# EAGLE design uc4h cube carrier v0310r-imx (EAGLE 7.5.0)
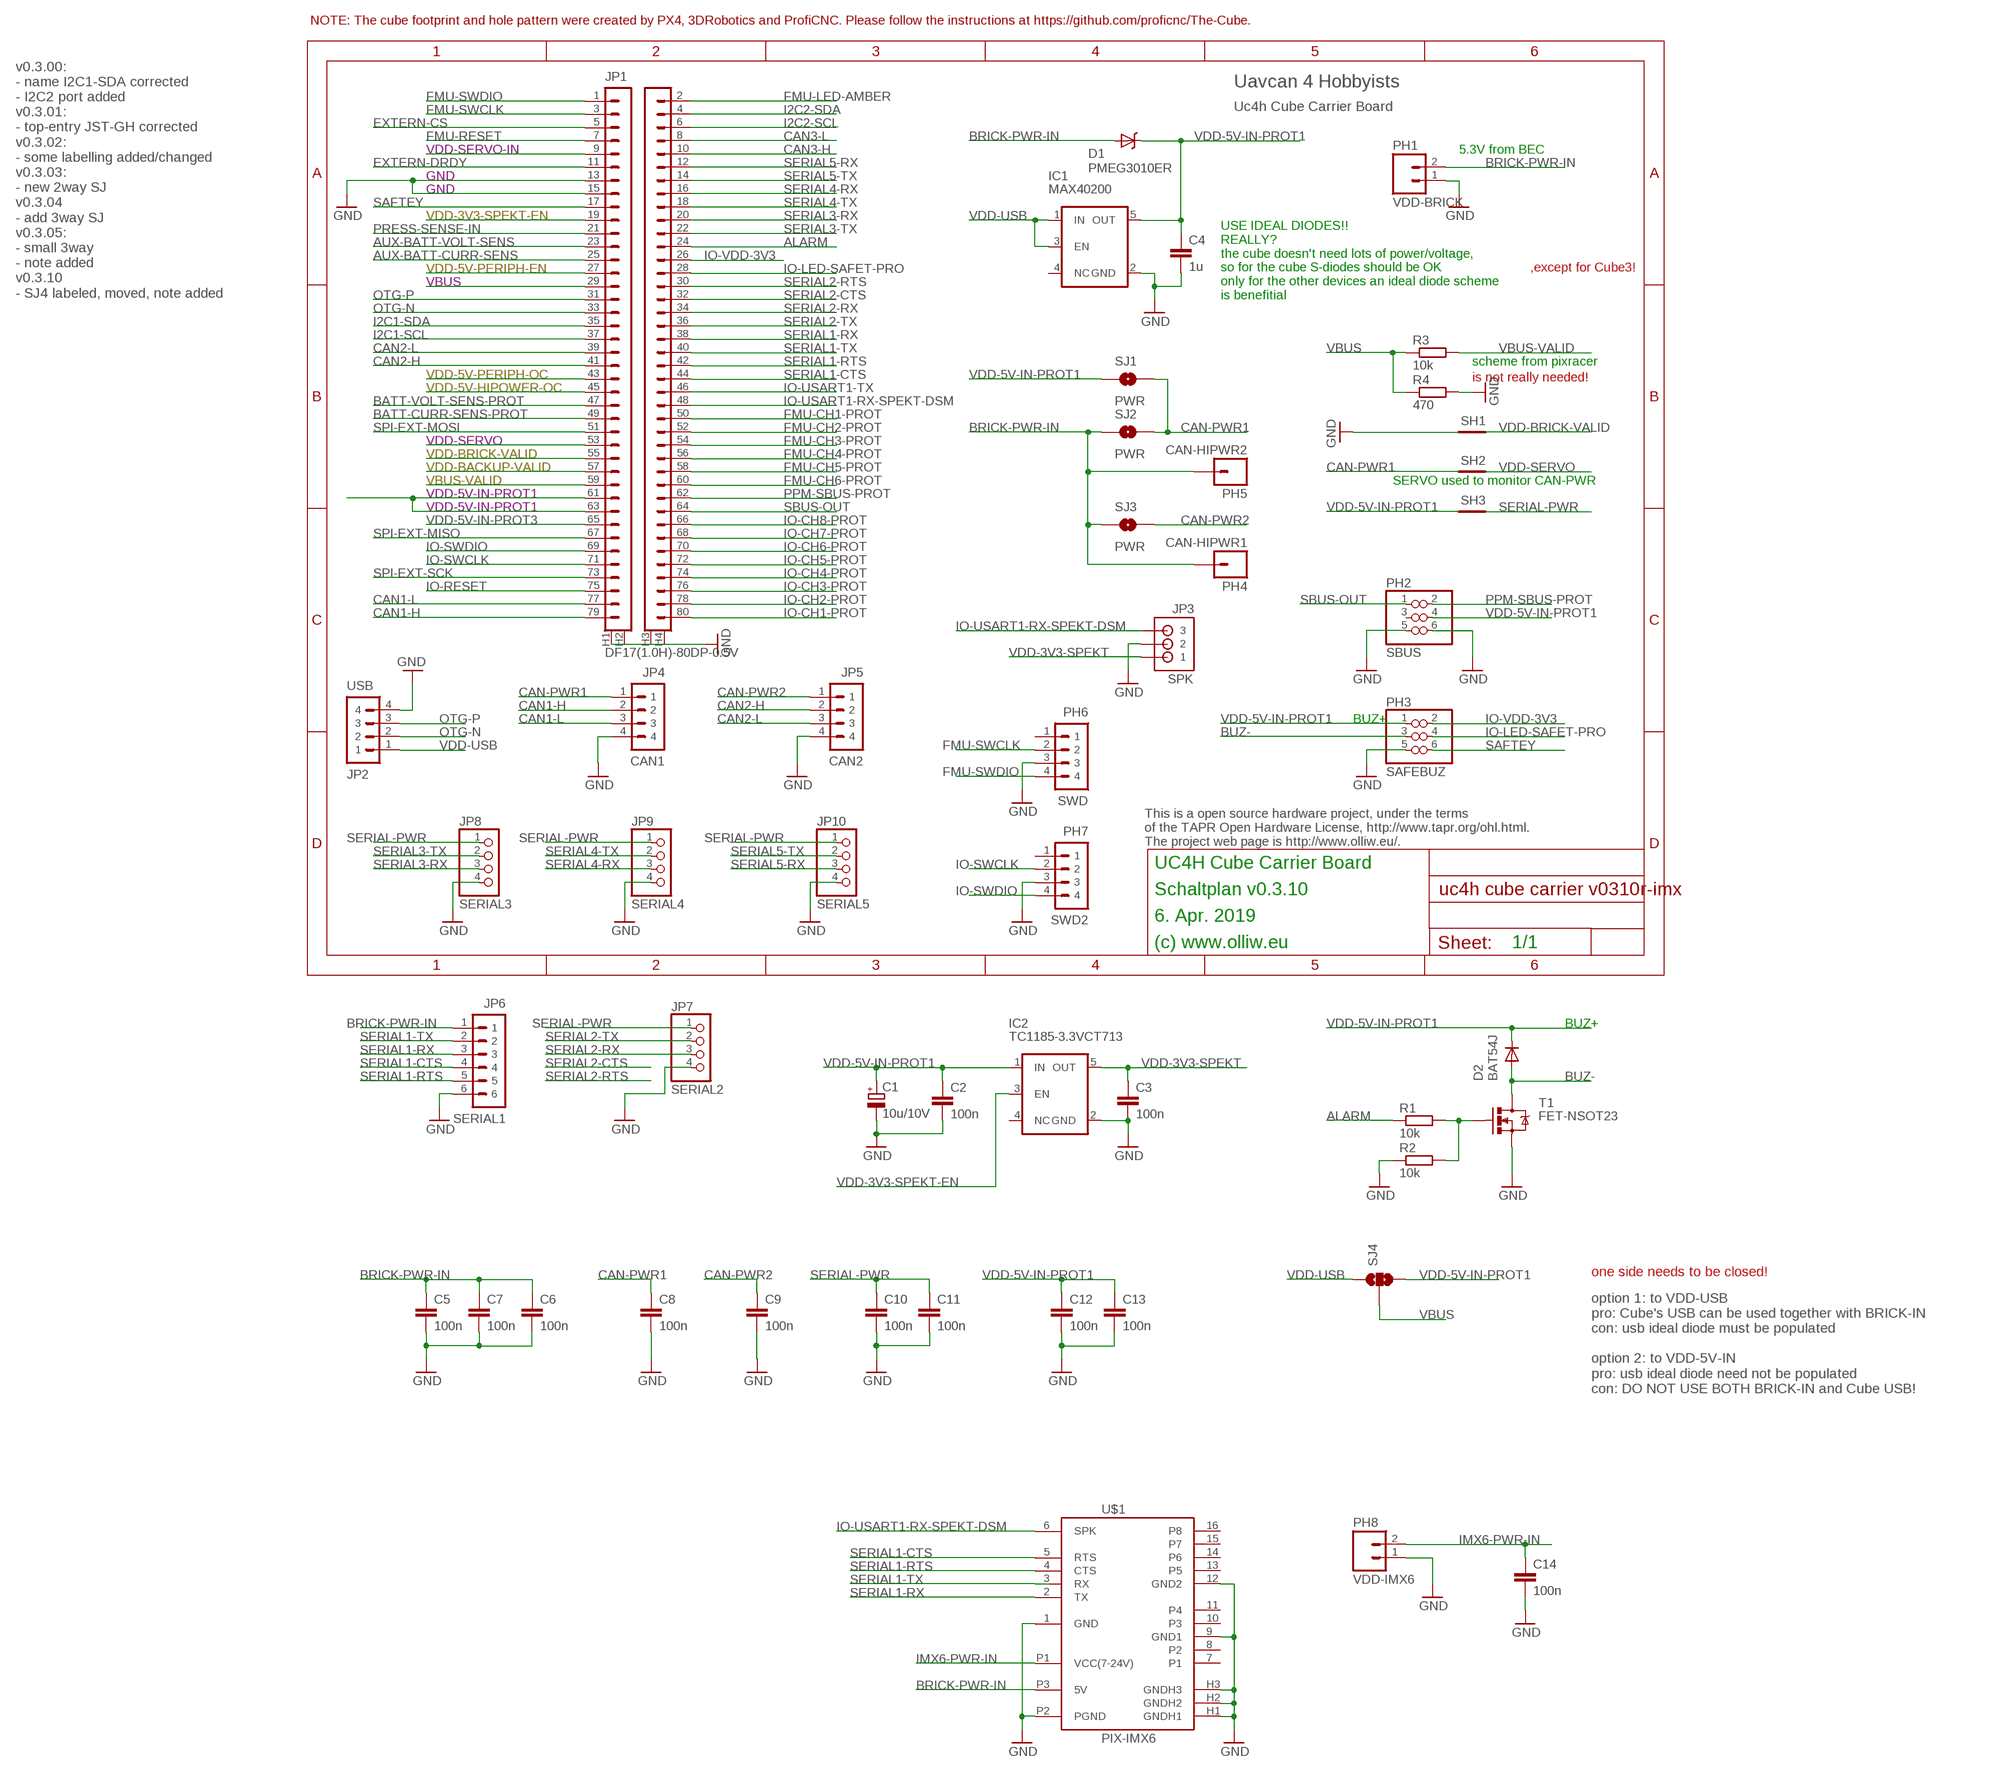
[diagram p0: schematic, sheet 1]

## Parts
C1  10u/10V  CPOL-EUSMCA  [SMC_A]
C2  100n  C-EUC0603  [C0603]
C3  100n  C-EUC0603  [C0603]
C4  1u  C-EUC0603  [C0603]
C5  100n  C-EUC0603  [C0603]
C6  100n  C-EUC0603  [C0603]
C7  100n  C-EUC0402  [C0402]
C8  100n  C-EUC0603  [C0603]
C9  100n  C-EUC0603  [C0603]
C10  100n  C-EUC0603  [C0603]
C11  100n  C-EUC0603  [C0603]
C12  100n  C-EUC0603  [C0603]
C13  100n  C-EUC0603  [C0603]
C14  100n  C-EUC0603  [C0603]
D1  PMEG3010ER  DIODE-SCHOTTKYSOD123-W  [SOD123W-DIODE]
D2  BAT54J  DIODE-SOD110-R  [SOD110-R]
IC1  MAX40200  V_REG_TPS76433SOT23-5  [SOT23-5]
IC2  TC1185-3.3VCT713  V_REG_TPS76433SOT23-5  [SOT23-5]
JP1  DF17(1.0H)-80DP-0.5V  PIX-CUBE-VIA  [PIX-CUBE-DF17(1.0H)-80DP-0.5V-VIA]
JP2  USB  JST-GH-4TOP-ENTRY  [BM04B-GHS-TBT]
JP3  SPK  B3B-ZR  [B3B-ZR]
JP4  CAN1  JST-GH-4TOP-ENTRY  [BM04B-GHS-TBT]
JP5  CAN2  JST-GH-4TOP-ENTRY  [BM04B-GHS-TBT]
JP6  SERIAL1  JST-GH-6TOP-ENTRY  [BM06B-GHS-TBT]
JP7  SERIAL2  PINHEAD_4X1  [PINHEAD_4X1]
JP8  SERIAL3  PINHEAD_4X1  [PINHEAD_4X1]
JP9  SERIAL4  PINHEAD_4X1  [PINHEAD_4X1]
JP10  SERIAL5  PINHEAD_4X1  [PINHEAD_4X1]
PH1  VDD-BRICK  M02PTH  [1X02]
PH2  SBUS  PINHEAD_3X2  [PINHEAD_3X2]
PH3  SAFEBUZ  PINHEAD_3X2  [PINHEAD_3X2]
PH4  CAN-HIPWR1  M01PTH  [1X01]
PH5  CAN-HIPWR2  M01PTH  [1X01]
PH6  SWD  P4X1_1P27-OCT_BILEX  [4X1_1P27_OCT_BILEX]
PH7  SWD2  P4X1_1P27-OCT_BILEX  [4X1_1P27_OCT_BILEX]
PH8  VDD-IMX6  M02PTH  [1X02]
R1  10k  R-EU_R0402  [R0402]
R2  10k  R-EU_R0402  [R0402]
R3  10k  R-EU_R0402  [R0402]
R4  470  R-EU_R0402  [R0402]
SH1  SHORT-HT5  [SHORT_TOP-50]
SH2  SHORT-HT5  [SHORT_TOP-50]
SH3  SHORT-HT5  [SHORT_TOP-50]
SJ1  PWR  SJ-2WAY-WPASTECONNECT  [SJ-2WAY-BIG-WPASTEC]
SJ2  PWR  SJ-2WAY-STANDARD  [SJ-2WAY-BIG]
SJ3  PWR  SJ-2WAY-WPASTECONNECT  [SJ-2WAY-BIG-WPASTEC]
SJ4  SJ-3WAY-03  [SJ-3WAY-WPASTEC]
T1  FET-NSOT23  [SOT23]
U$1  PIX-IMX6  [PIX-IMX6]

## Nets
ALARM: JP1.24 R1.1
AUX-BATT-CURR-SENS: JP1.25
AUX-BATT-VOLT-SENS: JP1.23
BATT-CURR-SENS-PROT: JP1.49
BATT-VOLT-SENS-PROT: JP1.47
BRICK-PWR-IN: C5.1 C6.1 C7.1 D1.A JP6.1 PH1.2 PH4.1 PH5.1 SJ2.1 SJ3.1 U$1.P3(5V)
BUZ-: D2.A PH3.3 T1.3(D)
CAN1-H: JP1.79 JP4.2
CAN1-L: JP1.77 JP4.3
CAN2-H: JP1.41 JP5.2
CAN2-L: JP1.39 JP5.3
CAN3-H: JP1.10
CAN3-L: JP1.8
CAN-PWR1: C8.1 JP4.1 SH2.1 SJ1.2 SJ2.2
CAN-PWR2: C9.1 JP5.1 SJ3.2
EXTERN-CS: JP1.5
EXTERN-DRDY: JP1.11
FMU-CH1-PROT: JP1.50
FMU-CH2-PROT: JP1.52
FMU-CH3-PROT: JP1.54
FMU-CH4-PROT: JP1.56
FMU-CH5-PROT: JP1.58
FMU-CH6-PROT: JP1.60
FMU-LED-AMBER: JP1.2
FMU-RESET: JP1.7
FMU-SWCLK: JP1.3 PH6.2
FMU-SWDIO: JP1.1 PH6.4
GND: C1.- C2.2 C3.2 C4.2 C5.2 C6.2 C7.2 C8.2 C9.2 C10.2 C11.2 C12.2 C13.2 C14.2 IC1.2(GND) IC2.2(GND) JP1.13 JP1.15 JP1.H1 JP1.H2 JP1.H3 JP1.H4 JP2.4 JP3.2 JP4.4 JP5.4 JP6.6 JP7.4 JP8.4 JP9.4 JP10.4 PH1.1 PH2.5 PH2.6 PH3.5 PH6.3 PH7.3 PH8.1 R2.1 R4.2 SH1.1 T1.2(S) U$1.1(GND) U$1.9(GND1) U$1.12(GND2) U$1.H1(GNDH1) U$1.H2(GNDH2) U$1.H3(GNDH3) U$1.P2(PGND)
I2C1-SCL: JP1.37
I2C1-SDA: JP1.35
I2C2-SCL: JP1.6
I2C2-SDA: JP1.4
IMX6-PWR-IN: C14.1 PH8.2 U$1.P1(VCC(7-24V))
IO-CH1-PROT: JP1.80
IO-CH2-PROT: JP1.78
IO-CH3-PROT: JP1.76
IO-CH4-PROT: JP1.74
IO-CH5-PROT: JP1.72
IO-CH6-PROT: JP1.70
IO-CH7-PROT: JP1.68
IO-CH8-PROT: JP1.66
IO-LED-SAFET-PRO: JP1.28 PH3.4
IO-RESET: JP1.75
IO-SWCLK: JP1.71 PH7.2
IO-SWDIO: JP1.69 PH7.4
IO-USART1-RX-SPEKT-DSM: JP1.48 JP3.3 U$1.6(SPK)
IO-USART1-TX: JP1.46
IO-VDD-3V3: JP1.26 PH3.2
N$1: R1.2 R2.2 T1.1(G)
OTG-N: JP1.33 JP2.2
OTG-P: JP1.31 JP2.3
PPM-SBUS-PROT: JP1.62 PH2.2
PRESS-SENSE-IN: JP1.21
SAFTEY: JP1.17 PH3.6
SBUS-OUT: JP1.64 PH2.1
SERIAL1-CTS: JP1.44 JP6.4 U$1.5(RTS)
SERIAL1-RTS: JP1.42 JP6.5 U$1.4(CTS)
SERIAL1-RX: JP1.38 JP6.3 U$1.2(TX)
SERIAL1-TX: JP1.40 JP6.2 U$1.3(RX)
SERIAL2-CTS: JP1.32
SERIAL2-RTS: JP1.30
SERIAL2-RX: JP1.34 JP7.3
SERIAL2-TX: JP1.36 JP7.2
SERIAL3-RX: JP1.20 JP8.3
SERIAL3-TX: JP1.22 JP8.2
SERIAL4-RX: JP1.16 JP9.3
SERIAL4-TX: JP1.18 JP9.2
SERIAL5-RX: JP1.12 JP10.3
SERIAL5-TX: JP1.14 JP10.2
SERIAL-PWR: C10.1 C11.1 JP7.1 JP8.1 JP9.1 JP10.1 SH3.2
SPI-EXT-MISO: JP1.67
SPI-EXT-MOSI: JP1.51
SPI-EXT-SCK: JP1.73
VBUS: JP1.29 R3.1 R4.1 SJ4.2
VBUS-VALID: JP1.59 R3.2
VDD-3V3-SPEKT: C3.1 IC2.5(OUT) JP3.1
VDD-3V3-SPEKT-EN: IC2.3(EN) JP1.19
VDD-5V-HIPOWER-OC: JP1.45
VDD-5V-IN-PROT1: C1.+ C2.1 C4.1 C12.1 C13.1 D1.C D2.C IC1.5(OUT) IC2.1(IN) JP1.61 JP1.63 PH2.4 PH3.1 SH3.1 SJ1.1 SJ4.3
VDD-5V-IN-PROT3: JP1.65
VDD-5V-PERIPH-EN: JP1.27
VDD-5V-PERIPH-OC: JP1.43
VDD-BACKUP-VALID: JP1.57
VDD-BRICK-VALID: JP1.55 SH1.2
VDD-SERVO: JP1.53 SH2.2
VDD-SERVO-IN: JP1.9
VDD-USB: IC1.1(IN) IC1.3(EN) JP2.1 SJ4.1
Unconnected: IC1.4(NC) IC2.4(NC) PH2.3 PH6.1 PH7.1 U$1.7(P1) U$1.8(P2) U$1.10(P3) U$1.11(P4) U$1.13(P5) U$1.14(P6) U$1.15(P7) U$1.16(P8)

## Notes on the sheet
- NOTE: The cube footprint and hole pattern were created by PX4, 3DRobotics and ProfiCNC. Please follow the instructions at https://github.com/proficnc/The-Cube.
- v0.3.00:
  - name I2C1-SDA corrected
  - I2C2 port added
  v0.3.01:
  - top-entry JST-GH corrected
  v0.3.02:
  - some labelling added/changed
  v0.3.03:
  - new 2way SJ
  v0.3.04
  - add 3way SJ
  v0.3.05:
  - small 3way
  - note added
  v0.3.10
  - SJ4 labeled, moved, note added
- Uavcan 4 Hobbyists
- Uc4h Cube Carrier Board
- 5.3V from BEC
- ,except for Cube3!
- USE IDEAL DIODES!!
  REALLY?
  the cube doesn't need lots of power/voltage,
  so for the cube S-diodes should be OK
  only for the other devices an ideal diode scheme
  is benefitial
- scheme from pixracer
- is not really needed!
- SERVO used to monitor CAN-PWR
- BUZ+
- This is a open source hardware project, under the terms
  of the TAPR Open Hardware License, http://www.tapr.org/ohl.html.
  The project web page is http://www.olliw.eu/.
- UC4H Cube Carrier Board
- Schaltplan v0.3.10
- 6. Apr. 2019
- (c) www.olliw.eu | 1/1
- BUZ+
- one side needs to be closed!
- option 1: to VDD-USB
  pro: Cube's USB can be used together with BRICK-IN
  con: usb ideal diode must be populated
  
  option 2: to VDD-5V-IN
  pro: usb ideal diode need not be populated
  con: DO NOT USE BOTH BRICK-IN and Cube USB!

## Library data of the parts
C1 = rcl:CPOL-EU: POLARIZED CAPACITOR, European symbol
C2-C14 = rcl:C-EU: CAPACITOR, European symbol
D1 = # stdlib:DIODE-SCHOTTKY
D2 = diode:DIODE-: DIODE
IC1 IC2 = # SparkFun2:V_REG_TPS76433: Voltage Regulator Older TI part. LDO 150mA regulator. No output by-pass cap option. See V_REG_LDO for a better part.
JP1 = # stdlib:PIX-CUBE
JP2 JP4 JP5 = # stdlib:JST-GH-4
JP3 = # jst:B3B-ZR: JST-ZH Connector 3 pol, 1.5mm pitch Package: B3B-ZR Source: http://www.jst-mfg.com/product/pdf/eng/eZH.pdf
JP6 = # stdlib:JST-GH-6
JP7-JP10 = # stdlib:PINHEAD_4X1
PH1 PH8 = # SparkFun2:M02: Header 2 Standard 2-pin 0.1" header. Use with straight break away headers (SKU : PRT-00116), right angle break away headers (PRT-00553), swiss pins (PRT-00743), machine pins (PRT-00117), and female headers (PRT-00115). Molex polarized connector foot print use with SKU : PRT-08233 with associated crimp pins and housings.
PH2 PH3 = # stdlib:PINHEAD_3X2
PH4 PH5 = # SparkFun:M01: Header 1 Standard 1-pin 0.1" header. Use with straight break away headers (SKU : PRT-00116), right angle break away headers (PRT-00553), swiss pins (PRT-00743), machine pins (PRT-00117), and female headers (PRT-00115).
PH6 PH7 = # stdlib:P4X1_1P27
R1-R4 = rcl:R-EU_: RESISTOR, European symbol
SH1-SH3 = shorts:SHORT-H: Short between two nets; BOM: no
SJ1-SJ3 = # stdlib:SJ-2WAY
SJ4 = # stdlib:SJ-3WAY
T1 = # stdlib:FET-N
U$1 = # stdlib:PIX-IMX6

## Board
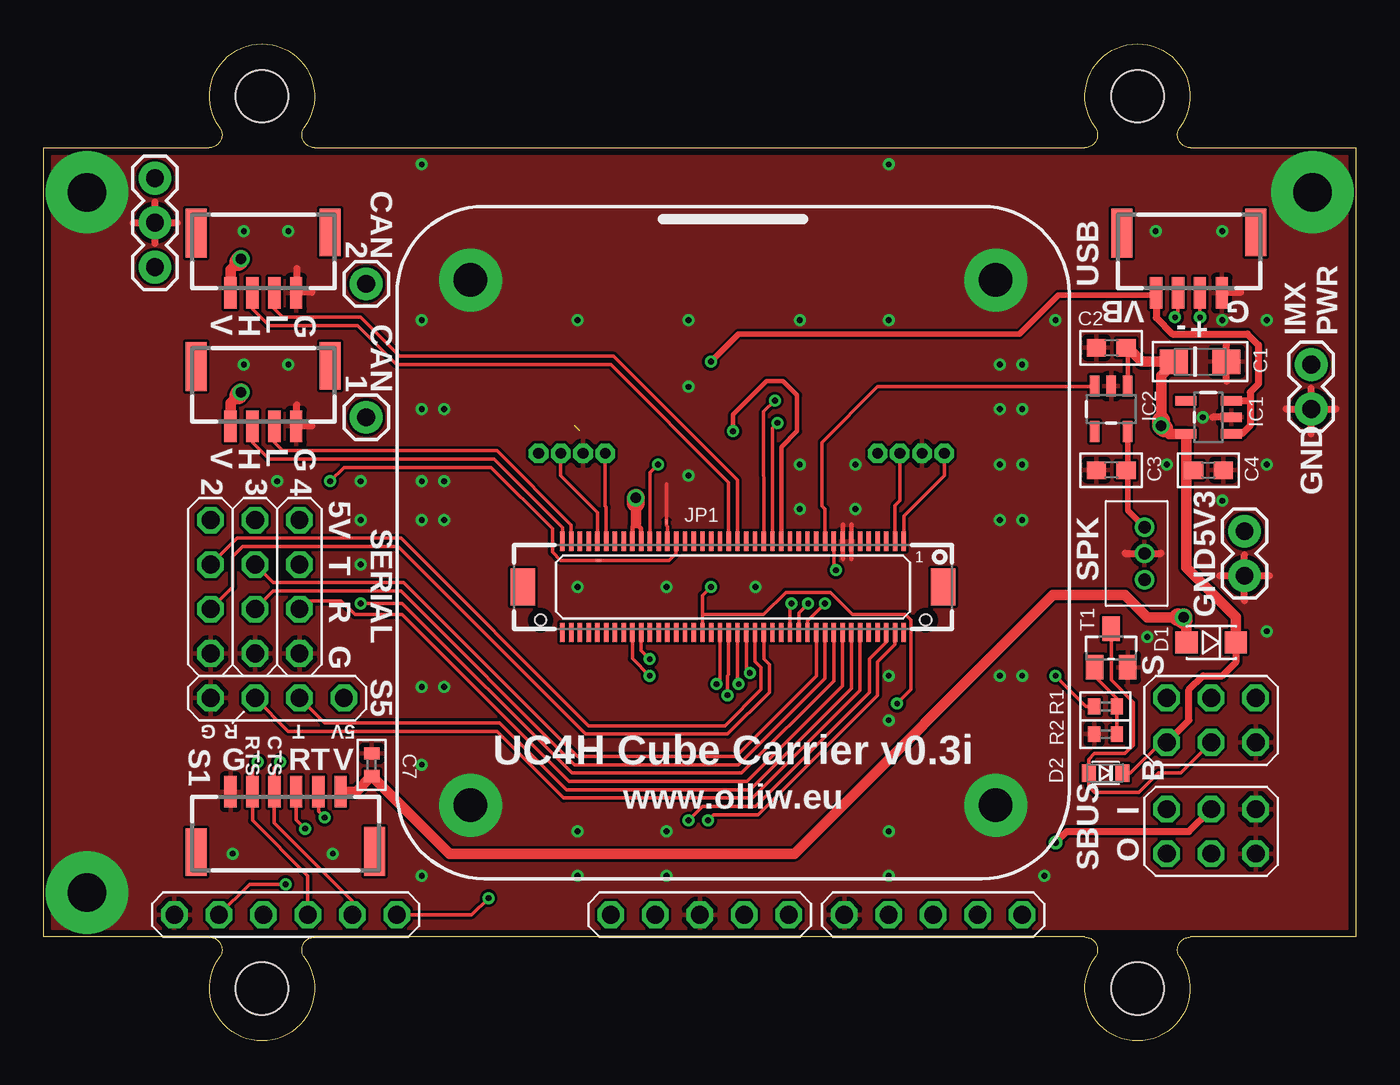
[diagram p1: board, top side]
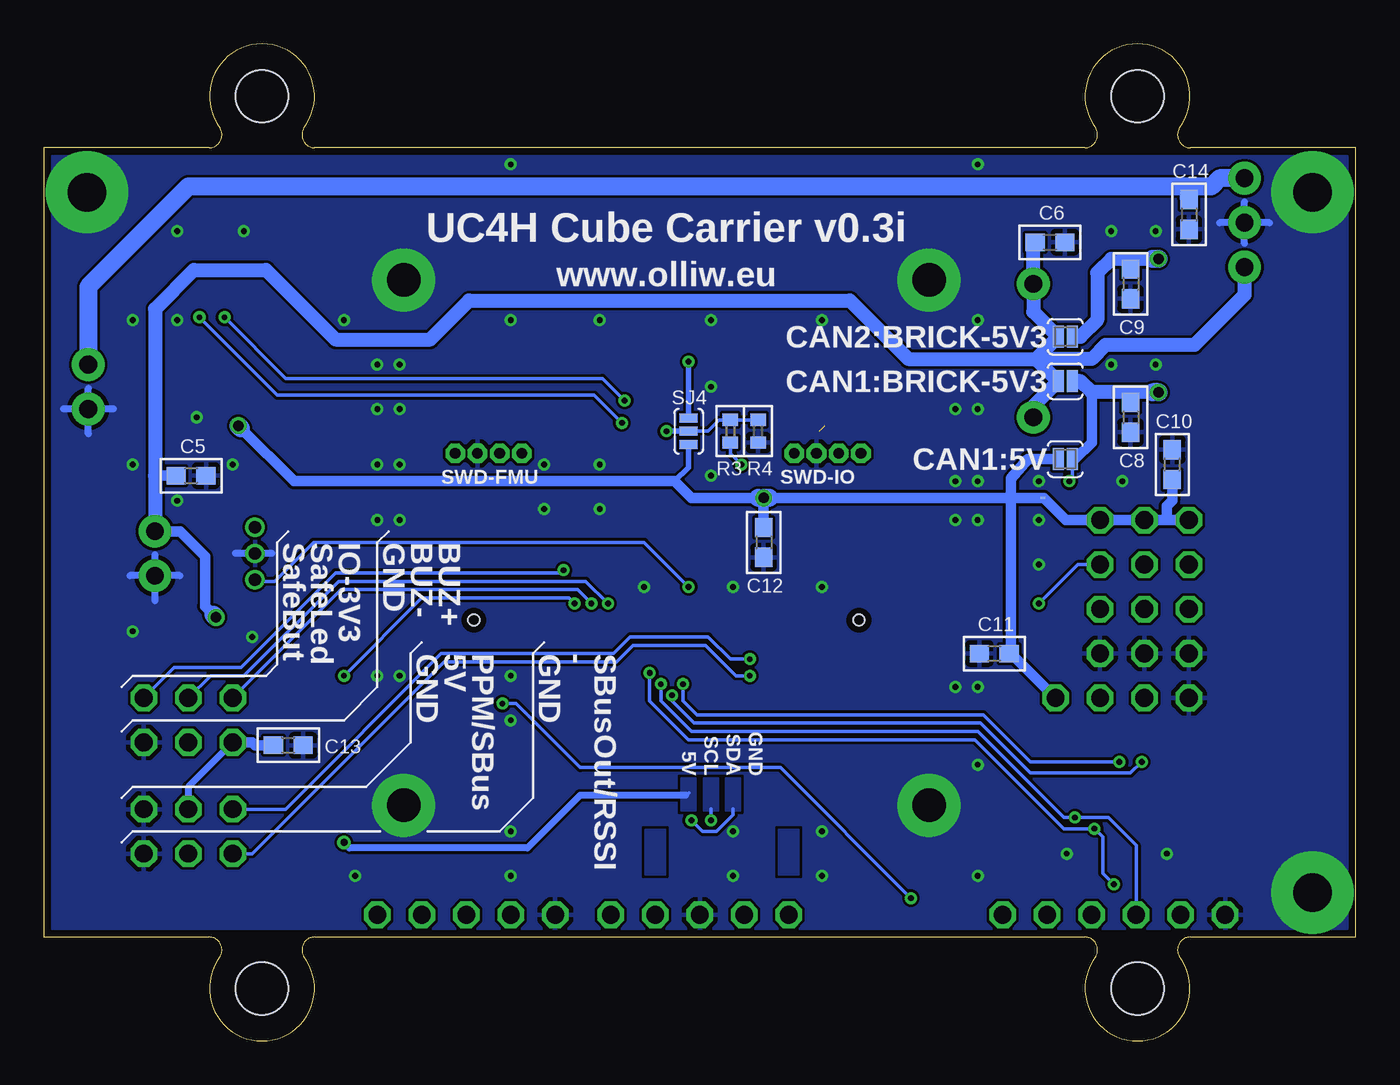
[diagram p2: board, bottom side, seen from below]

Size 74.93 x 56.96 mm. Coordinates in mm from the lower left corner, seen from the top.
Copper layers (1*16): Top 0.0356mm / dielectric 1.5011mm / Bottom 0.0356mm
Design rules "ow-oshpark-2layer": minimum track width 6mil, minimum drill 13mil, track to track 6mil, track to pad 6mil, pad to pad 6mil, via to via 6mil, smd to smd 6mil, copper to edge 15mil, drill to drill 6mil, minimum pad ring 7mil, minimum via ring 7mil, stop-mask expansion 2.5mil, vias tented up to drill 26mil, thermal gap 10mil

### Footprints (pad centres in the part's own frame; a part is rotated, then mirrored left to right if it is on the bottom)
SMC_A = smd 1.6 x 1.4: + -1.5,0; - 1.5,0
C0603 = smd 1.1 x 1: 1 -0.85,0; 2 0.85,0
C0402 = smd 0.7 x 0.9: 1 -0.65,0; 2 0.65,0
SOD123W-DIODE = smd 1.27 x 1.27: A -1.4,0; C 1.4,0
SOD110-R = smd 0.8 x 1: A 0.95,0; C -0.95,0
SOT23-5 = smd 0.55 x 1.2: 1 -0.95,-1.3; 2 0,-1.3; 3 0.95,-1.3; 4 0.95,1.3; 5 -0.95,1.3
PIX-CUBE-DF17(1.0H)-80DP-0.5V-VIA = smd 0.25 x 1.1: 1 9.75,2.6; 2 9.75,-2.6; 3 9.25,2.6; 4 9.25,-2.6; 5 8.75,2.6; 6 8.75,-2.6; 7 8.25,2.6; 8 8.25,-2.6; 9 7.75,2.6; 10 7.75,-2.6; 11 7.25,2.6; 12 7.25,-2.6; 13 6.75,2.6; 14 6.75,-2.6; 15 6.25,2.6; 16 6.25,-2.6; 17 5.75,2.6; 18 5.75,-2.6; 19 5.25,2.6; 20 5.25,-2.6; 21 4.75,2.6; 22 4.75,-2.6; 23 4.25,2.6; 24 4.25,-2.6; 25 3.75,2.6; 26 3.75,-2.6; 27 3.25,2.6; 28 3.25,-2.6; 29 2.75,2.6; 30 2.75,-2.6; 31 2.25,2.6; 32 2.25,-2.6; 33 1.75,2.6; 34 1.75,-2.6; 35 1.25,2.6; 36 1.25,-2.6; 37 0.75,2.6; 38 0.75,-2.6; 39 0.25,2.6; 40 0.25,-2.6; 41 -0.25,2.6; 42 -0.25,-2.6; 43 -0.75,2.6; 44 -0.75,-2.6; 45 -1.25,2.6; 46 -1.25,-2.6; 47 -1.75,2.6; 48 -1.75,-2.6; 49 -2.25,2.6; 50 -2.25,-2.6; 51 -2.75,2.6; 52 -2.75,-2.6; 53 -3.25,2.6; 54 -3.25,-2.6; 55 -3.75,2.6; 56 -3.75,-2.6; 57 -4.25,2.6; 58 -4.25,-2.6; 59 -4.75,2.6; 60 -4.75,-2.6; 61 -5.25,2.6; 62 -5.25,-2.6; 63 -5.75,2.6; 64 -5.75,-2.6; 65 -6.25,2.6; 66 -6.25,-2.6; 67 -6.75,2.6; 68 -6.75,-2.6; 69 -7.25,2.6; 70 -7.25,-2.6; 71 -7.75,2.6; 72 -7.75,-2.6; 73 -8.25,2.6; 74 -8.25,-2.6; 75 -8.75,2.6; 76 -8.75,-2.6; 77 -9.25,2.6; 78 -9.25,-2.6; 79 -9.75,2.6; 80 -9.75,-2.6 | drill 1.9 pad 3.6: H1 -15,17.53; H2 -15,-12.47; H3 15,-12.47; H4 15,17.53 | smd 1.4 x 2.1: SIT1 12,0; SIT2 -12,0 | hole 0.65: -11,-1.9; 11,-1.9
BM04B-GHS-TBT = smd 0.7 x 1.8: 1 1.875,4.8; 2 0.625,4.8; 3 -0.625,4.8; 4 -1.875,4.8 | smd 1.2 x 2.7: FIT@1 -3.825,1.35 | smd 1.2 x 2.8: FIT@2 3.825,1.4
B3B-ZR = drill 0.7 pad 1.1: 1 -1.5,0; 2 0,0; 3 1.5,0
BM06B-GHS-TBT = smd 0.7 x 1.8: 1 3.145,4.8; 2 1.875,4.8; 3 0.605,4.8; 4 -0.645,4.8; 5 -1.895,4.8; 6 -3.145,4.8 | smd 1.2 x 2.7: FIT@1 -5.095,1.35 | smd 1.2 x 2.8: FIT@2 5.095,1.4
PINHEAD_4X1 = drill 1.016 octagon: 1 0,7.62; 2 0,5.08; 3 0,2.54; 4 0,0
1X02 = drill 1.016 pad 1.88: 1 0,0; 2 2.54,0
PINHEAD_3X2 = drill 1.016 octagon: 1 0,0; 2 2.54,0; 3 0,-2.54; 4 2.54,-2.54; 5 0,-5.08; 6 2.54,-5.08
1X01 = drill 1.016 pad 1.88: 1 0,0
4X1_1P27_OCT_BILEX = drill 0.61 pad 1.118 octagon: 1 0,0; 2 0,-1.27; 3 0,-2.54; 4 0,-3.81
R0402 = smd 0.7 x 0.9: 1 -0.65,0; 2 0.65,0
SHORT_TOP-50 = smd 0.152 x 0.152: 1 0,0; 2 0.127,0
SJ-2WAY-BIG-WPASTEC = smd 0.635 x 1.27: 1 -0.4,0; 2 0.413,0
SJ-2WAY-BIG = smd 0.635 x 1.27: 1 -0.4,0; 2 0.413,0
SJ-3WAY-WPASTEC = smd 0.508 x 1.016: 1 -0.762,0; 2 0,0; 3 0.762,0
SOT23 = smd 1 x 1.4: 1 -0.95,-1.1; 2 0.95,-1.1; 3 0,1.1
PIX-IMX6 = drill 1.016 octagon: 1 30.004,21.273; 2 27.464,21.273; 3 24.924,21.273; 4 22.384,21.273; 5 19.844,21.273; 6 17.304,21.273; 7 5.08,21.273; 8 2.54,21.273; 9 0,21.273; 10 -2.54,21.273; 11 -5.08,21.273; 12 -8.255,21.273; 13 -10.795,21.273; 14 -13.335,21.273; 15 -15.875,21.273; 16 -18.415,21.273 | drill 2.2 pad 4.7: H1 -35.004,-20.003; H2 35.004,-20.003; H3 35.004,20.003 | drill 1.016 pad 1.88: P1 31.115,-20.796; P2 31.115,-18.256; P3 31.115,-15.716 | hole 3: -25.003,25.479; 25.003,25.479; 25.003,-25.479; -25.003,-25.479

### Placement (x,y rotation side)
C1  66.04,38.8 0 top
C2  60.96,39.59 180 top
C3  60.96,32.61 180 top
C4  66.52,32.61 0 top
C5  66.52,32.29 0 bottom
C6  17.46,45.62 0 bottom
C7  18.73,15.78 90 top
C8  12.86,35.62 270 bottom
C9  12.86,43.24 270 bottom
C10  10.48,32.92 90 bottom
C11  20.64,22.13 180 bottom
C12  33.81,28.48 270 bottom
C13  60.96,16.89 0 bottom
C14  9.53,47.21 270 bottom
D1  66.67,22.76 0 top
D2  60.64,15.3 180 top
IC1  66.52,35.62 90 top
IC2  60.96,36.1 180 top
JP1  39.37,25.94 0 top
JP2  65.41,47.53 180 top
JP3  62.87,27.84 270 top
JP4  12.54,39.91 180 top
JP5  12.54,47.53 180 top
JP6  13.81,9.43 0 top
JP7  9.53,22.13 0 top
JP8  12.07,22.13 0 top
JP9  14.61,22.13 0 top
JP10  9.53,19.59 270 top
PH1  68.58,26.57 90 top
PH2  64.14,10.7 90 top
PH3  64.14,17.05 90 top
PH4  18.42,35.62 0 top
PH5  18.42,43.24 0 top
PH6  47.63,33.56 90 top
PH7  28.26,33.56 90 top
PH8  72.39,36.1 90 top
R1  60.64,19.11 0 top
R2  60.64,17.53 0 top
R3  35.72,34.83 270 bottom
R4  34.13,34.83 270 bottom
SH1  35.56,29.59 90 top
SH2  31.75,27.45 180 top
SH3  17.94,31.02 0 bottom
SJ1  16.59,33.24 0 bottom
SJ2  16.59,37.69 0 bottom
SJ3  16.59,40.23 0 bottom
SJ4  38.1,34.83 270 bottom
T1  60.96,22.45 0 top
U$1  37.47,28.48 180 top

### Tracks (layer width: path | path; a pad name or v marks a point on that pad's centre or on a via)
ALARM  (via drill 0.33)
  Top 0.203: JP1.24 43.62,24 v44.61,24.99 | v57.79,20.86 59.53,19.11 R1.1
  Bottom 0.203: v44.61,24.99 44.93,25.3 53.34,25.3 v57.79,20.86
BRICK-PWR-IN  (via drill 0.6)
  Top 0.61: 65.09,24.03 65.25,23.88 65.25,23.27 D1.A | 64.77,24.19 63.02,24.19 61.75,25.46 57.63,25.46 42.86,10.7 23.18,10.7 18.73,15.14 C7.1 17.83,14.23 JP6.1
  Top 1.016: 64.77,24.19 v65.09,24.19 65.09,24.03
  Bottom 0.406: 17.15,40.07 SJ3.1 17.13,39.91 17.15,40.39 | 17.15,37.85 SJ2.1 17.15,37.53 | 18.42,45.36 C6.1
  Bottom 0.61: PH1.2 67.15,29.11 65.72,27.69 65.72,24.83 65.25,24.35 | C5.1 68.58,32.29
  Bottom 0.813: 18.26,38.96 25.56,38.96 28.89,42.29 50.64,42.29 52.86,40.07 58.26,40.07 62.23,44.04 66.36,44.04 68.58,41.81 68.58,32.29 PH1.2 | 17.15,40.07 18.26,38.96 | 17.15,37.85 18.26,38.96 | 17.15,40.39 18.42,41.66 PH5.1 18.42,45.36 | PH4.1 18.42,36.26 17.15,37.53 | U$1.P3 6.35,42.61 9.21,39.75 14.29,39.75 15.08,38.96 18.26,38.96
  Bottom 1.016: 65.25,24.35 v65.09,24.19
BUZ-
  Top 0.203: PH3.3 64.93,15.3 63.66,15.3 62.55,14.19 60.01,14.19 59.69,14.51 59.69,15.14 D2.A 59.69,15.15 59.69,16.1 60.01,16.41 61.75,16.41 62.23,16.89 62.23,19.35 60.96,20.62 T1.3
CAN1-H
  Top 0.203: JP1.79 29.62,29.34 25.72,33.24 12.86,33.24 11.92,34.18 JP4.2
CAN1-L
  Top 0.203: JP1.77 30.12,29.47 25.88,33.72 13.65,33.72 13.17,34.2 JP4.3
CAN2-H
  Top 0.203: JP1.41 39.12,31.9 32.39,38.64 20.16,38.64 17.94,40.86 12.86,40.86 11.92,41.8 JP5.2
CAN2-L
  Top 0.203: JP1.39 39.62,32.04 32.54,39.12 20.32,39.12 18.1,41.34 13.65,41.34 13.17,41.82 JP5.3
CAN-PWR1  (via drill 0.33, 0.6)
  Top 0.203: SH2.1 29.53,27.45 29.05,27.92 29.05,29.27 25.56,32.77 17.15,32.77 v16.35,31.97
  Top 0.61: JP4.1 10.67,36.45 v11.27,37.05
  Top 1.016: 11.11,36.89 v11.27,37.05
  Bottom 0.203: v16.35,31.97 16.19,32.13 16.19,33.23 SJ1.2
  Bottom 0.406: SJ2.2 16.03,37.69 | 16.05,33.24 SJ1.2
  Bottom 0.61: 16.05,33.24 16.03,33.24 15.08,34.19 15.08,37.05 | C8.1 12.86,37.05
  Bottom 0.813: 16.03,37.69 15.72,37.69 15.08,37.05 12.86,37.05 11.59,37.05
  Bottom 1.016: v11.27,37.05 11.59,37.05
CAN-PWR2  (via drill 0.6)
  Top 0.61: JP5.1 10.67,44.07 v11.27,44.67
  Top 1.016: 11.11,44.51 v11.27,44.67
  Bottom 0.406: 16.03,40.23 SJ3.2
  Bottom 0.61: C9.1 12.86,44.67
  Bottom 0.813: 16.03,40.23 15.72,40.23 14.76,41.18 14.76,43.88 13.97,44.67 12.86,44.67 11.59,44.67
  Bottom 1.016: v11.27,44.67 11.59,44.67
FMU-SWCLK
  Top 0.203: JP1.3 48.62,30.59 48.9,30.86 PH6.2
FMU-SWDIO
  Top 0.203: JP1.1 49.12,29.97 51.44,32.29 PH6.4
GND  (via drill 0.33)  (1 unrouted)
  Top 0.203: SH1.1 35.56,31.81
  Top 0.254: 46.12,29.51 46.12,27.53 | 45.64,29.51 45.64,27.53
  Top 0.406: 67.15,26.57 70.01,26.57 | 68.58,25.15 68.58,27.77 | 67.71,35.62 66.75,35.62 | 67.55,37.69 67.55,39.75 | 61.75,27.84 63.82,27.84 | 67.39,42.77 68.34,42.77 | 15.32,42.77 14.37,42.77 | 14.37,35.15 15.32,35.15 | 14.45,35.39 14.45,36.34 | 14.45,44.12 14.45,43.16 | 70.96,36.1 73.82,36.1 | 72.39,34.67 72.39,37.29 | 5.08,46.74 7.62,46.74 | 6.35,45.55 6.35,47.93
  Bottom 0.406: 67.15,26.57 70.01,26.57 | 68.58,25.15 68.58,27.77 | 61.91,27.84 63.98,27.84 | 70.96,36.1 73.82,36.1 | 72.39,34.67 72.39,37.29 | 4.92,46.74 7.78,46.74 | 6.35,45.55 6.35,47.93
  other vias: 57.15,9.43 69.85,23.4 69.85,32.92 64.14,32.92 63.02,23.08 48.26,11.97 48.26,18.32 48.26,20.86 46.36,32.92 55.88,32.92 55.88,29.75 46.36,30.38 40.64,25.94 35.56,25.94 30.48,25.94 36.83,32.29 22.86,31.97 22.86,36.1 36.83,37.37 36.83,41.18 21.59,41.18 57.79,41.18 48.26,41.18 35.56,11.97 30.48,11.97 22.86,29.75 30.48,9.43 35.56,9.43 48.26,9.43 21.59,9.43 55.88,20.86 21.59,36.1 21.59,31.97 21.59,29.75 11.43,46.26 11.43,38.64 22.86,20.22 21.59,20.22 21.59,15.78 43.18,32.92 30.48,41.18 18.1,27.21 18.1,31.97 13.34,31.97 13.97,46.26 13.97,38.64 55.88,36.1 18.1,29.75 43.18,30.38 54.61,36.1 54.61,32.92 54.61,29.75 67.31,30.86 66.2,35.62 69.85,41.18 43.18,41.18 67.31,46.26 63.5,46.26 54.61,38.64 55.88,38.64 54.61,20.86 67.31,41.18 21.59,50.07 48.26,50.07 16.51,10.7 10.8,10.7
  pour Bottom (isolate 0.152, rank 6): 0.48,50.55 74.45,50.55 74.45,6.41 0.48,6.41
  pour Top (isolate 0.152, rank 6): 0.48,50.55 74.45,50.55 74.45,6.41 0.48,6.41
I2C2-SCL  (via drill 0.33)
  Top 0.203: JP1.6 48.12,22.78 47.15,21.81 47.15,19.91 40.64,13.4 37.62,13.4 v36.83,12.6
  Bottom 0.203: v36.83,12.6 36.83,13.27
  pour Bottom: 37.23,14.99 37.23,13.16 36.43,13.16 36.43,14.99
I2C2-SDA  (via drill 0.33)
  Top 0.203: JP1.4 48.62,22.65 47.63,21.65 47.63,19.75 40.8,12.92 38.26,12.92 v37.94,12.6
  Bottom 0.203: v37.94,12.6 37.31,11.97 36.51,11.97 35.56,12.92 35.56,13.27
  pour Bottom: 35.16,14.99 35.96,14.99 35.96,13.16 35.16,13.16
IMX6-PWR-IN
  Bottom 1.016: U$1.P1 7.78,49.28 8.26,48.8 9.53,48.8 | 9.53,48.8 66.67,48.8 72.39,43.08 PH8.2 | C14.1 9.53,48.8
IO-LED-SAFET-PRO  (via drill 0.33)
  Top 0.203: JP1.28 42.62,24.9 v42.7,24.99
  Bottom 0.203: v42.7,24.99 43.97,26.26 58.1,26.26 63.5,20.86 65.41,20.86 PH3.4
IO-SWCLK
  Top 0.203: JP1.71 31.62,30.2 29.53,32.29 PH7.2
IO-SWDIO
  Top 0.203: JP1.69 32.12,30.49 32.07,30.54 PH7.4
IO-USART1-RX-SPEKT-DSM  (via drill 0.33)
  Top 0.203: JP1.48 37.62,24.35 | 37.62,24.35 37.62,25.46 v38.1,25.94 | v48.74,19.27 49.53,20.07 49.53,24.03 49.21,24.35 46.2,24.35 44.93,25.62 42.39,25.62 41.12,24.35 37.62,24.35 | U$1.6 24.45,7.21 v25.4,8.16
  Bottom 0.203: v38.1,25.94 40.64,28.48 59.53,28.48 61.75,26.26 62.78,26.26 JP3.3 | v25.4,8.16 32.86,15.62 44.29,15.62 47.94,19.27 v48.74,19.27
IO-VDD-3V3  (via drill 0.33)
  Top 0.203: JP1.26 43.12,24.45 v43.66,24.99
  Bottom 0.203: v43.66,24.99 44.45,25.78 57.94,25.78 PH3.2
N$1
  Top 0.203: R2.2 R1.2 61.29,19.57 60.01,20.86 T1.1
N$2
  pour Bottom: 31.83,12.05 32.94,12.05 32.94,9.51 31.83,9.51
N$3
  pour Bottom: 39.45,12.05 40.56,12.05 40.56,9.51 39.45,9.51
OTG-N  (via drill 0.33)
  Top 0.203: JP1.33 41.12,35.94 v41.76,36.58 | JP2.2 64.78,41.51 v64.61,41.34
  Bottom 0.203: v64.61,41.34 61.12,37.85 43.02,37.85 v41.76,36.58
OTG-P  (via drill 0.33)
  Top 0.203: JP1.31 41.62,35.02 v41.91,35.31 | JP2.3 v66.03,41.35 v66.04,41.34
  Bottom 0.203: v66.04,41.34 61.6,36.89 43.5,36.89 v41.91,35.31
PPM-SBUS-PROT  (via drill 0.33)
  Top 0.203: JP1.62 34.12,22.3 v34.61,21.81
  Bottom 0.203: v34.61,21.81 35.72,21.81 36.99,23.08 41.43,23.08 42.39,22.13 52.23,22.13 61.12,13.24 PH2.2
SAFTEY  (via drill 0.33)
  Top 0.203: JP1.17 45.12,27.02 v45.24,26.89
  Bottom 0.203: PH3.6 67.47,21.34 63.66,21.34 58.26,26.73 45.4,26.73 v45.24,26.89
SBUS-OUT  (via drill 0.33)
  Top 0.203: v34.61,20.86 33.62,21.85 JP1.64
  Bottom 0.203: v34.61,20.86 35.4,20.86 37.15,22.61 41.28,22.61 42.23,21.65 52.07,21.65 63.02,10.7 PH2.1
SERIAL1-CTS  (via drill 0.33)
  Top 0.203: JP1.44 38.62,20.59 v38.42,20.38 | v13.49,15.94 13.17,15.61 JP6.4 13.17,12.46 17.62,8 U$1.5
  Bottom 0.203: v38.42,20.38 38.42,19.43 37.62,18.64 21.27,18.64 18.57,15.94 v13.49,15.94
SERIAL1-RTS  (via drill 0.33)
  Top 0.203: JP1.42 39.12,20.93 39.05,20.86 v39.05,19.75 | v12.22,15.94 11.92,15.63 JP6.5 11.92,12.59 15.08,9.43 U$1.4
  Bottom 0.203: v39.05,19.75 39.05,19.43 37.78,18.16 21.43,18.16 18.57,15.3 12.86,15.3 v12.22,15.94
SERIAL1-RX  (via drill 0.33)
  Top 0.203: JP1.38 40.12,21.22 v40.32,21.02 | JP6.3 14.42,12.63 v14.92,12.13 | U$1.2 11.75,8.95 v13.81,8.95
  Bottom 0.203: v40.32,21.02 40.32,19.43 38.1,17.21 21.75,17.21 16.67,12.13 v14.92,12.13 14.45,11.65 14.45,9.59 v13.81,8.95
SERIAL1-TX  (via drill 0.33)
  Top 0.203: JP1.40 39.62,20.47 v39.69,20.38 | JP6.2 15.69,13.11 v16.03,12.76
  Bottom 0.203: v39.69,20.38 39.69,19.43 37.94,17.68 21.59,17.68 16.67,12.76 v16.03,12.76 14.13,12.76 12.54,11.18 U$1.3
SERIAL2-RX
  Top 0.203: JP1.34 41.12,21.81 41.43,21.49 41.43,19.91 39.05,17.53 30.96,17.53 20.24,28.24 11.35,28.24 10.8,27.69 10.8,25.94 JP7.3
SERIAL2-TX
  Top 0.203: JP1.36 40.62,21.67 40.96,21.34 40.96,20.07 38.89,18 31.12,18 20.4,28.72 11.03,28.72 JP7.2
SERIAL3-RX
  Top 0.203: JP1.20 44.62,20.71 39.69,15.78 30.32,15.78 20.4,25.7 13.1,25.7 JP8.3
SERIAL3-TX
  Top 0.203: JP1.22 44.12,20.85 39.53,16.26 30.48,16.26 20.56,26.18 13.1,26.18 JP8.2
SERIAL4-RX
  Top 0.203: JP1.16 45.62,20.28 40.16,14.83 30,14.83 20.48,24.35 17.78,24.35 16.99,25.15 15.08,25.15 JP9.3
SERIAL4-TX  (via drill 0.33)
  Top 0.203: JP1.18 45.12,20.58 39.85,15.3 30.16,15.3 20.48,24.99 v18.1,24.99
  Bottom 0.203: JP9.2 15.88,27.21 v18.1,24.99
SERIAL5-RX
  Top 0.203: JP1.12 46.62,20.01 40.48,13.87 29.69,13.87 25.88,17.68 13.97,17.68 JP10.3
SERIAL5-TX
  Top 0.203: JP1.14 46.12,20.15 40.32,14.35 29.85,14.35 26.04,18.16 16.03,18.16 JP10.2
SERIAL-PWR
  Bottom 0.61: JP10.1 19.69,22.13 | 19.69,22.13 19.69,31.02 SH3.2 16.54,29.75 JP9.1 JP8.1 10.8,29.75 | C11.1 19.69,22.13 | C10.1 10.48,30.86 10.8,30.54 10.8,29.75 | 10.8,29.75 JP7.1
VBUS  (via drill 0.33)
  Top 0.254: JP1.29 42.12,33.93 43.02,34.83 43.02,36.89 42.23,37.69 41.28,37.69 39.37,35.78 v39.37,34.83
  Bottom 0.203: SJ4.2 36.99,34.83 36.35,35.46 35.73,35.46 R3.1 R4.1
  Bottom 0.305: v39.37,34.83 SJ4.2
VBUS-VALID  (via drill 0.33)
  Top 0.203: JP1.59 34.62,32.46 v35.08,32.92
  Bottom 0.203: R3.2 35.72,33.56 v35.08,32.92
VDD-3V3-SPEKT
  Top 0.254: C3.1 61.81,32.55 61.91,32.45
  Top 0.305: IC2.5 61.91,32.71 C3.1 | 61.91,32.45 61.91,30.3 JP3.1
VDD-3V3-SPEKT-EN
  Top 0.203: JP1.19 44.62,30.38 44.45,30.55 44.45,34.19 47.63,37.37 59.98,37.37 IC2.3
VDD-5V-IN-PROT1  (via drill 0.4, 0.6)
  Top 0.203: PH3.1 63.82,17.05 62.07,15.3 D2.C
  Top 0.254: IC2.1 61.91,39.49 C2.1 | JP1.63 33.62,29.4 33.81,29.59 34.12,29.28 JP1.61
  Top 0.305: C4.1 65.25,32.61
  Top 0.406: PH3.1 65.41,18.32 65.41,20.07 66.2,20.86 67.31,20.86 68.1,21.65 68.1,22.63 D1.C | v57.79,11.33 58.42,11.97 65.41,11.97 PH2.4
  Top 0.61: 64.56,38.5 C1.+ | C1.+ 64.45,38.55 64.45,38.64 63.82,38 63.82,35.46 | 33.81,29.59 33.81,30.7 | D1.C 68.08,24.22 65.25,27.05 65.25,32.61 65.25,34.64 IC1.5 64.29,34.67 v63.82,35.15 | C2.1 61.91,39.59 62.71,38.8 C1.+
  Top 1.016: 33.81,30.7 v33.81,31.02 | 63.82,35.46 v63.82,35.15 63.98,34.99
  Bottom 0.203: 38.07,14.16 38.26,14.03
  Bottom 0.305: SJ4.3 38.1,32.77 38.89,31.97
  Bottom 0.406: PH3.1 66.67,14.51 PH2.4 | SJ1.1 17.15,33.24 | 38.26,14.03 44.29,14.03 47.31,11.02 57.47,11.02 v57.79,11.33
  Bottom 0.61: C12.1 v33.81,31.02 | C13.1 62.87,16.89 63.02,17.05 PH3.1 | SH3.1 19.69,31.02 | 19.69,31.02 33.5,31.02 | 34.13,31.02 37.94,31.02 38.89,31.97 60.64,31.97 63.66,34.99 | 19.69,31.02 19.69,32.13 18.73,33.24 17.15,33.24
  Bottom 1.016: 33.5,31.02 v33.81,31.02 34.13,31.02 | v63.82,35.15 63.66,34.99
  pour Bottom: 37.7,14.99 38.5,14.99 38.5,13.16 37.7,13.16
VDD-BRICK-VALID
  Top 0.203: JP1.55 35.62,29.37 35.56,29.43 SH1.2
VDD-SERVO
  Top 0.203: JP1.53 36.12,27.85 35.72,27.45 SH2.2
VDD-USB  (via drill 0.33)
  Top 0.305: JP2.1 63.41,42.61 57.94,42.61 55.72,40.39 39.69,40.39 v38.1,38.8
  Top 0.406: JP2.1 63.53,41.31 64.45,40.39 68.74,40.39 69.37,39.75 69.37,37.53 68.9,37.05 68.9,36.58 | 68.9,36.58 68.9,35.15 68.42,34.67 IC1.1 | IC1.3 68.9,36.57 68.9,36.58
  Bottom 0.305: v38.1,38.8 SJ4.1

### Text on the board
tNames: 2 | CAN | USB | VB | G | V | H | L | G | - | + | IMX / PWR | 1 | CAN | V | H | L | G | 2 | 3 | 4 | GND | 5V | SERIAL | 5V3 | T | SPK | R | GND | G | S5 | S | G | R | T | 5V | S1 | G | RTS | CTS | R | T | V | UC4H Cube Carrier v0.3i | B | www.olliw.eu | I | O | SBUS
bNames: UC4H Cube Carrier v0.3i | www.olliw.eu | CAN2:BRICK-5V3 | CAN1:BRICK-5V3 | CAN1:5V | SWD-IO | SWD-FMU | BUZ+ | BUZ- | GND | IO-3V3 | SafeLed | SafeBut | SBusOut/RSSI | - | GND | PPM/SBus | 5V | GND | GND | SDA | SCL | 5V